# Altium project 2019_VL53_Fixator.PrjPcb
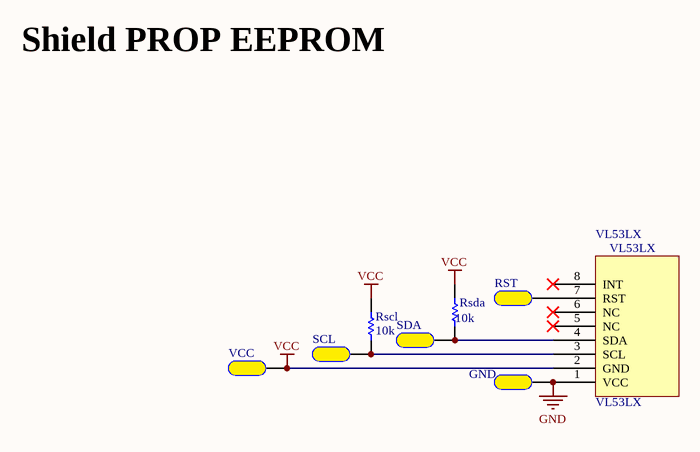
[diagram p0: 2019_VL53_Fixator.SchDoc]
1 sheet, 8 parts. Net scope: global (net labels, ports and power ports of the same name join across sheets).
Board file: 2019_VL53_Fixator.PcbDoc

## Sheet 2019_VL53_Fixator.SchDoc
size A4

### Parts
GND  Pad_CMS  [PAD_CMS_10x3]  (value not drawn)
Rscl  10k  [R0805_N]
Rsda  10k  [R0805_N]
RST  Pad_CMS  [PAD_CMS_10x3]  (value not drawn)
SCL  Pad_CMS  [PAD_CMS_10x3]  (value not drawn)
SDA  Pad_CMS  [PAD_CMS_10x3]  (value not drawn)
VCC  Pad_CMS  [PAD_CMS_10x3]  (value not drawn)
VL53LX  VL53LX  [VL53LX]

### Nets
GND: GND.1 VL53LX.1(VCC)
VCC: Rscl.1 Rsda.1 VCC.1 VL53LX.2(GND)
NetRscl_2: Rscl.2 SCL.1 VL53LX.3(SCL)
NetRsda_2: Rsda.2 SDA.1 VL53LX.4(SDA)
NetRST_1: RST.1 VL53LX.7(RST)

Not connected (* = marked no-connect by the designer): VL53LX 5(NC)* 6(NC)* 8(INT)*

### Notes on the sheet
- Shield PROP EEPROM
- Title
- Size:
- Date:
- A4
- Number:
- Time:
- Revision:
- Sheet
- of
- File:

### Library data of the parts
GND RST SCL SDA VCC = Pad_CMS: Pad pour souder un fil; LatestRevisionNote: Mech Layer 1 removed.; PackageReference: PAD_CMS; Publisher: Damien Guitton
Rscl Rsda = Resistor: Published: 8-Jun-2000; LatestRevisionDate: 17-Jul-2002; LatestRevisionNote: Re-released for DXP Platform.; PackageReference: AXIAL-0.5; Publisher: Altium Limited